# EAGLE design 5v_unit (EAGLE 9.6.2)
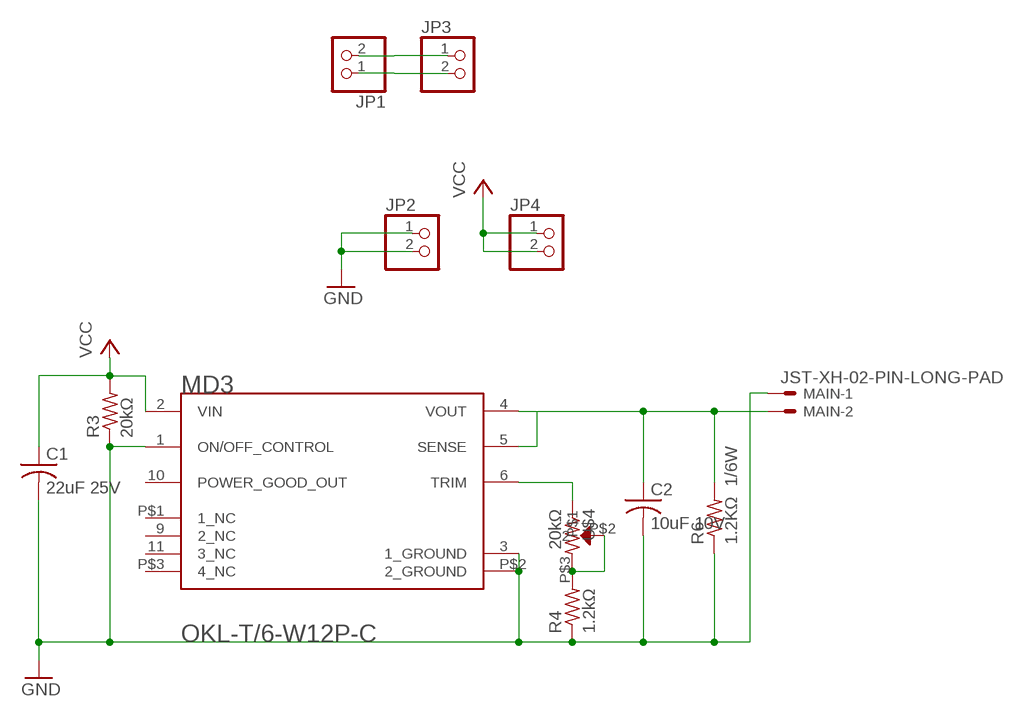
[diagram p0: schematic, sheet 1]

## Parts
C1  22uF 25V  C-USC2012  [C2012]
C2  10uF 10V  C-USC2012  [C2012]
JP1  PINHD-1X2  [1X02]
JP2  PINHD-1X2  [1X02]
JP3  PINHD-1X2  [1X02]
JP4  PINHD-1X2  [1X02]
MAIN  JST-XH-02-PIN-LONG-PAD  [JST-XH-02-PACKAGE-LONG-PAD]
MD3  OKL-T/6-W12P-CMURATA_OKL-T-6-W12P-C_0_0  [MURATA_OKL-T-6-W12P-C_0]
R3  20kΩ  R-US_M2012  [M2012]
R4  1.2kΩ  R-US_M2012  [M2012]
R6  1.2KΩ 1/6W  FLIPFLOP-RES  [0805-THM]
U$4  20kΩ  R-TRIM  [R-TRIM]

## Nets
GND: C1.2 C2.2 JP2.1 JP2.2 MAIN.1 MD3.1(ON/OFF_CONTROL) MD3.3(1_GROUND) MD3.P$2(2_GROUND) R3.1 R4.1 R6.1
N$5: JP1.1 JP1.2 JP3.1 JP3.2
N$7: R4.2 U$4.P$2 U$4.P$3
N$8: C2.1 MAIN.2 MD3.4(VOUT) MD3.5(SENSE) R6.2
N$9: MD3.6(TRIM) U$4.P$1
VCC: C1.1 JP4.1 JP4.2 MD3.2(VIN) R3.2
Unconnected: MD3.9(2_NC) MD3.10(POWER_GOOD_OUT) MD3.11(3_NC) MD3.P$1(1_NC) MD3.P$3(4_NC)

## Library data of the parts
C1 C2 = adafruit:C-US: CAPACITOR, American symbol
JP1-JP4 = pinhead:PINHD-1X2: PIN HEADER
MAIN = Rembrandt Electronics - JST XH Connectors v1-0:JST-XH-02-PIN: JST XH Connector 2 Pin Wire to board connector. Pitch: 2,54 mm, (0.100") Number of pins: 2 Created by Rembrandt Electronics www.rembrandtelectronics.com
MD3 = OKL-T_6-W12P-C:OKL-T/6-W12P-C: Non-Isolated PoL Module DC DC Converter 1 Output 0.591 ~ 5.5V - - 6A 4.5V - 14V Input Check availability <https://pricing.snapeda.com/parts/OKL-T/6-W12P-C/Murata%20Power%20Solutions%20Inc./view-part?ref=eda>; AVAILABILITY: In Stock; DESCRIPTION: Non-Isolated PoL Module DC DC Converter 1 Output 0.591 ~ 5.5V - - 6A 4.5V - 14V Input; MF: Murata Power Solutions Inc.; MP: OKL-T/6-W12P-C; PACKAGE: BLGA-12 Murata Power Solutions; PRICE: None; PURCHASE-URL: https://pricing.snapeda.com/search/part/OKL-T/6-W12P-C/?ref=eda
R3 R4 = adafruit:R-US_: RESISTOR, American symbol
R6 = adafruit:FLIPFLOP-RES: Flip Flop resistor An 0805 resistor inside a standard 1/4W 5% resistor. Makes for easy mods
U$4 = by_hirame:R-TRIM

## Board
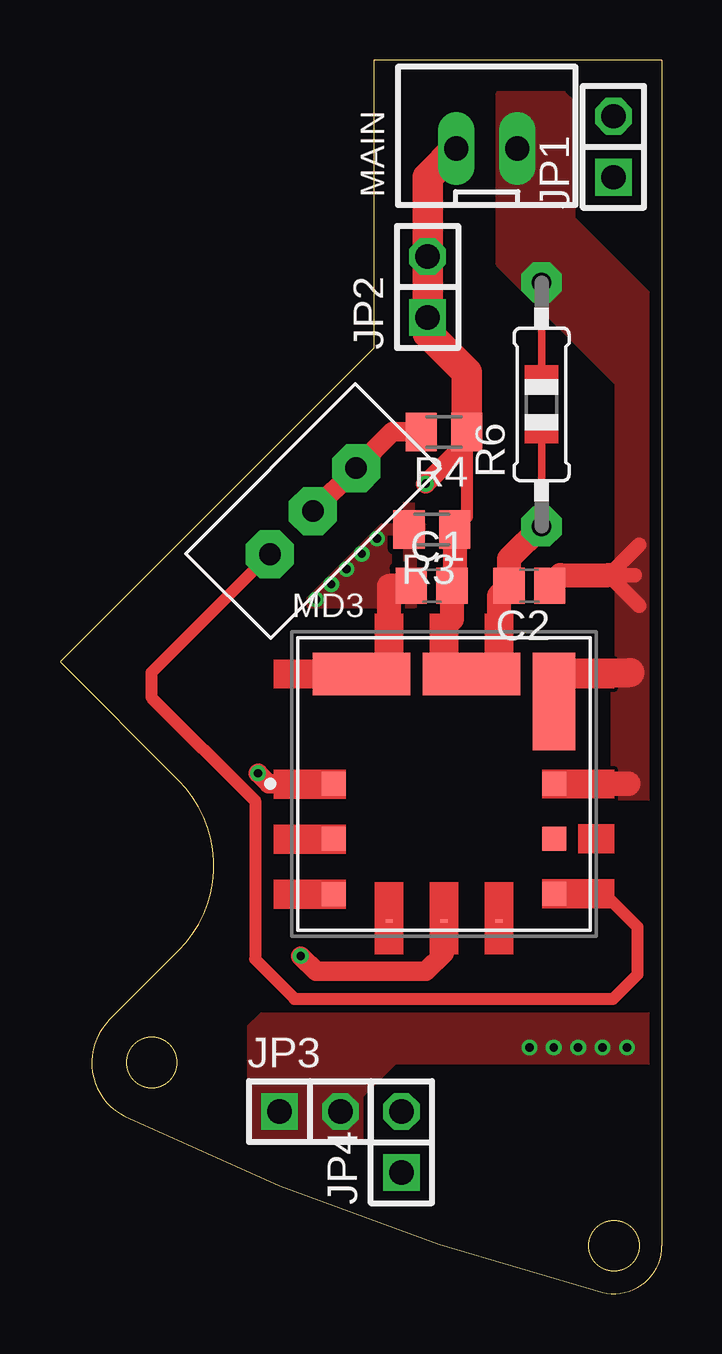
[diagram p1: board, top side]
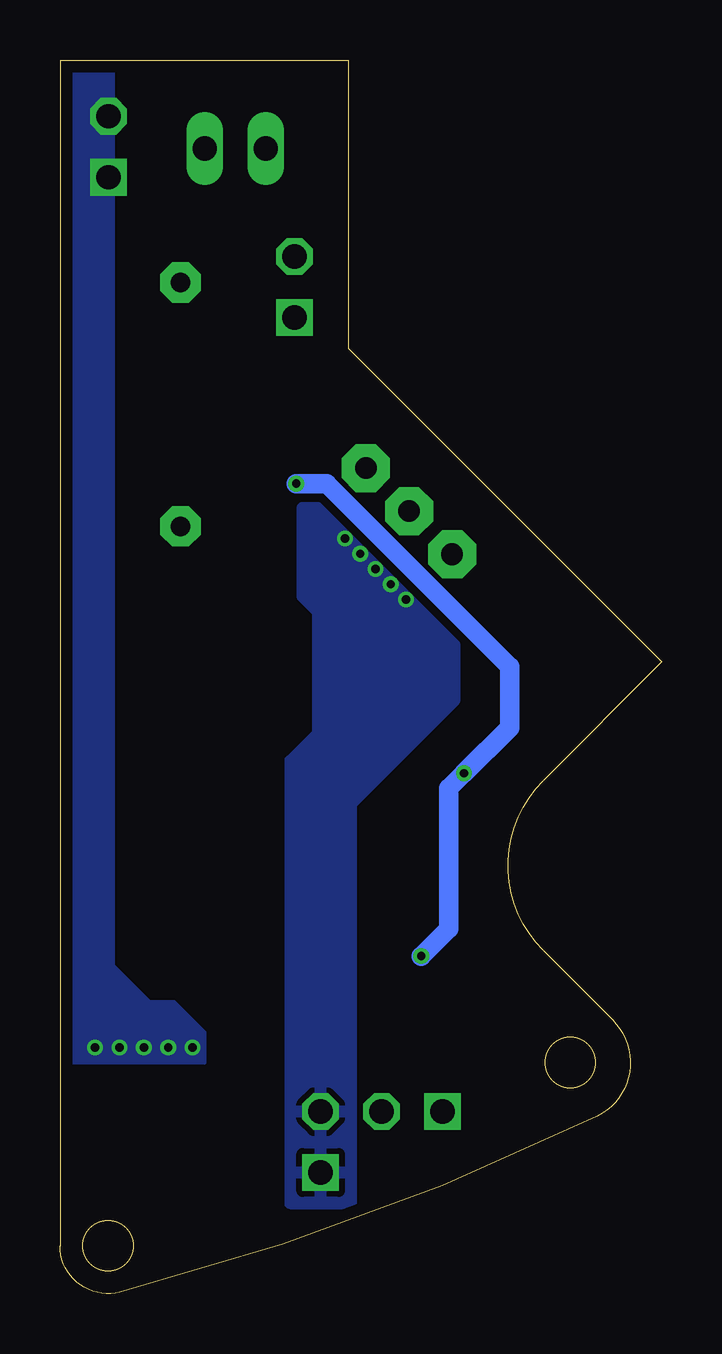
[diagram p2: board, bottom side, seen from below]

Size 25.08 x 51.4 mm. Coordinates in mm from the lower left corner, seen from the top.
Outline: 25.08,51.4 25.08,2 arc-104 22.59,0.06 arc-12 2.71,7.39 arc-109 2.06,11.41 4.95,14.3 arc90 4.95,21.37 0,26.32 13.08,39.4 13.08,51.4 25.08,51.4
Outline: circle at 23.08,2 radius 1.05
Outline: circle at 3.82,9.63 radius 1.05
Copper layers (1*16): Top 0.035mm / dielectric 1.6mm / Bottom 0.035mm
Design rules "Elecrow_2-layer_PCB_eagle_rule": minimum track width 6mil, minimum drill 12mil, track to track 6mil, track to pad 6mil, pad to pad 6mil, via to via 8mil, smd to smd 0mil, copper to edge 20mil, drill to drill 10mil, minimum pad ring 6mil, minimum via ring 6mil, stop-mask expansion 0mil, vias tented up to drill 100mil, thermal gap 10mil

### Footprints (pad centres in the part's own frame; a part is rotated, then mirrored left to right if it is on the bottom)
C2012 = smd 1.3 x 1.5: 1 -0.85,0; 2 0.85,0
1X02 = drill 1.016 square: 1 -1.27,0 | drill 1.016 octagon: 2 1.27,0
JST-XH-02-PACKAGE-LONG-PAD = drill 1.016 long: 1 -1.27,0; 2 1.27,0
MURATA_OKL-T-6-W12P-C_0 = smd 1 x 1: 1 -4.6,0; 5 4.6,0; 6 4.6,-4.58; 9 -4.6,-4.6; 10 -4.6,-2.29; 11 4.6,-2.29 | smd 4.07 x 1.77: 2 -3.435,4.585; 3 1.145,4.585 | smd 1.77 x 4.07: 4 4.585,3.435 | smd 0.305 x 0.152: P$1 -2.286,-5.715; P$2 0,-5.715; P$3 2.286,-5.715
M2012 = smd 1.3 x 1.6: 1 -0.95,0; 2 0.95,0
0805-THM = drill 0.813 pad 1.676 octagon: 1 -5.08,0; 2 5.08,0
R-TRIM = drill 0.9 pad 2 octagon: P$1 -2.54,0; P$2 0,0; P$3 2.54,0

### Placement (x,y rotation side)
C1  15.48,29.49 0 top
C2  19.56,29.49 180 top
JP1  23.06,47.79 90 top
JP2  15.31,41.94 90 top
JP3  10.41,7.58 0 top
JP4  14.22,6.31 90 top
MAIN  17.78,47.72 0 top
MD3  16,21.24 0 top
R3  15.49,31.84 180 top
R4  16,35.91 180 top
R6  20.07,37.05 90 top
U$4  10.54,32.6 45 top

### Tracks (layer width: path | path; a pad name or v marks a point on that pad's centre or on a via)
GND  (via drill 0.35)
  Top 0.508: R4.1 16.95,32.35 R3.1
  Top 0.813: MD3.P$2 16,14.19 15.24,13.43 10.67,13.43 v10.03,14.06 | v15.24,33.75 16.95,35.46 R4.1 | MD3.1 8.7,21.24 v8.26,21.68
  Top 1: R3.1 16.44,29.6 C1.2 16.33,28.11 16,27.78 16,25.82 MD3.3 18.29,25.82 18.29,29.07 C2.2 18.71,30.61 R6.1
  Top 1.27: MAIN.1 15.31,46.52 JP2.2 JP2.1 15.31,40.02 16.95,38.38 R4.1
  Bottom 0.813: v10.03,14.06 8.89,15.2 8.89,21.05 v8.26,21.68 6.35,23.59 6.35,26.13 13.97,33.75 v15.24,33.75
N$5  (via drill 0.35)
  other vias: 20.57,10.25 21.59,10.25 19.56,10.25 22.61,10.25 23.62,10.25
  pour Bottom (no thermals): 22.86,52.8 22.86,13.68 21.34,12.16 20.32,12.16 19.05,10.89 19.05,9.62 26.67,9.62 26.67,52.8
  pour Top (no thermals): 7.87,6.31 12.57,6.31 12.57,8.22 13.97,9.62 26.42,9.62 26.54,9.74 26.54,11.65 8.38,11.65 7.87,11.14
N$7
  Top 0.813: U$4.P$2 U$4.P$3 13.84,35.91 R4.2
N$8
  Top 0.61: 23.95,29.94 22.86,29.94 | 22.86,29.94 24.13,31.21 | 22.86,29.94 24.13,28.67
  Top 1: C2.1 20.85,29.94 22.86,29.94
  Top 1.016: MD3.5 23.69,21.24
  Top 1.2: MD3.4 20.59,25.87 23.75,25.87
  pour Top (no thermals): 20.19,20.6 26.16,20.6 26.16,26.38 20.83,26.38 20.83,25.24 22.99,25.24 22.99,21.81 20.19,21.81
  pour Top (no thermals): 18.29,50 20.95,50 21.34,49.62 21.34,44.8 24.13,42 26.04,40.1 26.04,23.71 23.37,23.71 23.24,23.84 23.24,26.13 23.24,37.94 19.56,41.62 18.29,42.89
N$9
  Top 0.508: U$4.P$1 3.81,25.87 3.81,24.86 8.13,20.54 8.13,13.93 9.78,12.28 23.05,12.28 24.06,13.3 24.06,15.27 22.68,16.66 MD3.6
VCC  (via drill 0.35)
  Top 1: MD3.2 13.72,25.82 13.72,29.49 C1.1 | 14.63,31.84 R3.2
  other vias: 10.67,28.92 11.3,29.56 11.94,30.19 12.57,30.83 13.21,31.46
  pour Bottom: 12.95,3.77 12.95,7.71 12.95,20.41 8.64,24.73 8.64,27.02 13.97,32.35 14.35,32.73 14.99,32.73 14.99,29.05 14.35,28.41 14.35,23.33 15.49,22.19 15.49,5.93 15.49,3.77
  pour Top: 14.35,32.73 14.99,32.73 14.99,29.05 14.86,28.92 14.73,28.79 10.41,28.79